# Altium project 20E-Bringup.PrjPcb (part 2 of 2)

## Sheet PWM-Generator.SchDoc
size A4
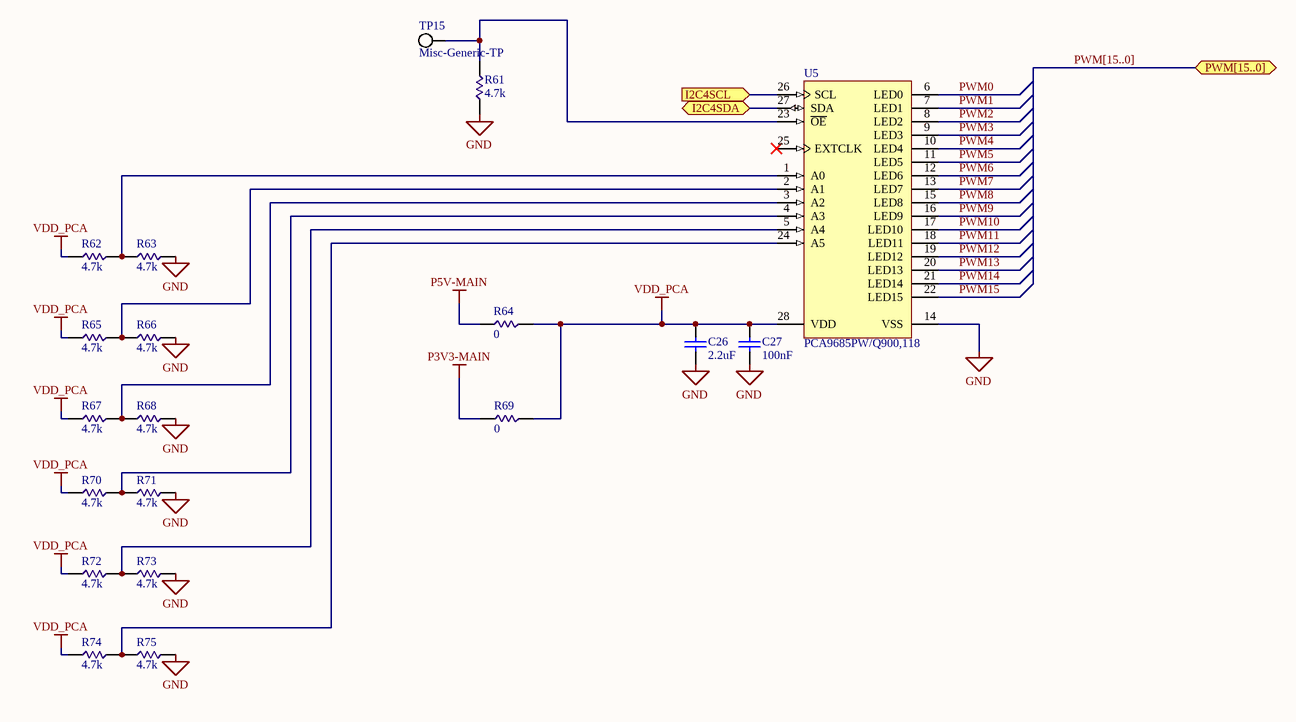
[diagram p11: PWM-Generator.SchDoc]

### Parts
C26  value 2.2uF  [FOOTPRINT-0805-GEN]  (hidden comment: C0805C225K8RACTU)
C27  value 100nF  [FOOTPRINT-0805-GEN]  (hidden comment: C0805C104K8RACTU)
R61  value 4.7k  [FOOTPRINT-0805-GEN]  (hidden comment: SMC)
R62  value 4.7k  [FOOTPRINT-0805-GEN]  (hidden comment: SMC)
R63  value 4.7k  [FOOTPRINT-0805-GEN]  (hidden comment: SMC)
R64  value 0  [FOOTPRINT-0805-GEN]  (hidden comment: SMC)
R65  value 4.7k  [FOOTPRINT-0805-GEN]  (hidden comment: SMC)
R66  value 4.7k  [FOOTPRINT-0805-GEN]  (hidden comment: SMC)
R67  value 4.7k  [FOOTPRINT-0805-GEN]  (hidden comment: SMC)
R68  value 4.7k  [FOOTPRINT-0805-GEN]  (hidden comment: SMC)
R69  value 0  [FOOTPRINT-0805-GEN]  (hidden comment: SMC)
R70  value 4.7k  [FOOTPRINT-0805-GEN]  (hidden comment: SMC)
R71  value 4.7k  [FOOTPRINT-0805-GEN]  (hidden comment: SMC)
R72  value 4.7k  [FOOTPRINT-0805-GEN]  (hidden comment: SMC)
R73  value 4.7k  [FOOTPRINT-0805-GEN]  (hidden comment: SMC)
R74  value 4.7k  [FOOTPRINT-0805-GEN]  (hidden comment: SMC)
R75  value 4.7k  [FOOTPRINT-0805-GEN]  (hidden comment: SMC)
TP15  Misc-Generic-TP  [FOOTPRINT-GENERIC-TP-VIA-1MM]
U5  PCA9685PW/Q900,118  [FOOTPRINT-NXP-PCA9685]

### Ports
I2C4SCL (in), I2C4SDA (bidir), PWM[15..0] (bidir)

### Nets
GND: C26.2 C27.1 R61.1 R63.2 R66.2 R68.2 R71.2 R73.2 R75.2 U5.14(VSS)
P3V3-MAIN: R69.1
P5V-MAIN: R64.2
VDD_PCA: C26.1 C27.2 R62.2 R64.1 R65.2 R67.2 R69.2 R70.2 R72.2 R74.2 U5.28(VDD)
I2C4SCL: U5.26(SCL) ; port I2C4SCL
I2C4SDA: U5.27(SDA) ; port I2C4SDA
PWM0: U5.6(LED0)
PWM1: U5.7(LED1)
PWM2: U5.8(LED2)
PWM3: U5.9(LED3)
PWM4: U5.10(LED4)
PWM5: U5.11(LED5)
PWM6: U5.12(LED6)
PWM7: U5.13(LED7)
PWM8: U5.15(LED8)
PWM9: U5.16(LED9)
PWM10: U5.17(LED10)
PWM11: U5.18(LED11)
PWM12: U5.19(LED12)
PWM13: U5.20(LED13)
PWM14: U5.21(LED14)
PWM15: U5.22(LED15)
NetR61_2: R61.2 TP15.1(TP) U5.23(~{OE})
NetR62_1: R62.1 R63.1 U5.1(A0)
NetR65_1: R65.1 R66.1 U5.2(A1)
NetR67_1: R67.1 R68.1 U5.3(A2)
NetR70_1: R70.1 R71.1 U5.4(A3)
NetR72_1: R72.1 R73.1 U5.5(A4)
NetR74_1: R74.1 R75.1 U5.24(A5)

Not connected (* = marked no-connect by the designer): U5 25(EXTCLK)*

### Buses and harness runs
bus PWM[15..0] = port PWM[15..0]

### Notes on the sheet
- Title
- Size:
- Date:
- Engineer
- A4
- Number:
- Sheet
- of
- Approved
- Revision:
- UC Riverside
- www.highlanderracing.org <https://www.highlanderracing.org>
- File:

### Library data of the parts
C26 C27 = Capacitor-Generic-0805: Capacitor; Published: 8-Jun-2000; LatestRevisionDate: 17-Jul-2002; LatestRevisionNote: Re-released for DXP Platform.; PackageReference: RAD-0.3; Publisher: Altium Limited; PackageDescription: Radial Cap, Thru-Hole; 2 Leads; 0.3 in Pin Spacing
R61-R75 = Resistor-Generic-0805-2012: 1/8 Watt Surface Mount Resistor
U5 = IC-NXP-PCA9685: 16-Channel, 12-Bit PWM Fm+ I2C-Bus LED Controller, 2.3 to 5.5 V, -40 to 85 degC, 28-Pin TSSOP (SOT361-1), RoHS, Tape and Reel; Supply Voltage Max: 5.5 V; Supply Current Max: 10 mA; Supply Voltage Min: 2.3 V; Frequency: 25000000 Hz; ComponentLink1Description: Manufacturer URL; PackageVersion: 02/2003; PackageDescription: 28-Pin Small Outline Package, Body 9.7 x 4.4 mm, Pitch 0.65 mm; Packing: Tape and Reel; ComponentLink2URL: http://www.nxp.com/documents/data_sheet/PCA9685.pdf; ComponentLink1URL: http://www.nxp.com/; Mounting Technology: Surface Mount; PartNumber: PCA9685; ComponentLink2Description: Datasheet; Temperature Min: -40 degC; ComponentLink3URL: http://www.nxp.com/documents/outline_drawing/sot361-1_po.pdf; Temperature Max: 85 degC; DatasheetVersion: Rev. 4; ComponentLink3Description: Package Specification; RoHS: TRUE; Code_JEDEC: MO-153

## Nets that join several sheets
GND: Connectors (29 pins), Power-Tree-VBATT-Filter (P24.1 P24.2), Power-Tree-Main (18 pins), Power-Tree-Secondary (17 pins), TM4C (22 pins), CAN-Interface (6 pins), Pin-Filters (11 pins), PWM-Generator (10 pins)
P3V3-MAIN: Connectors (P7.1 P18.22 R1.1), Power-Tree-Main (R84.2), Power-Tree-Secondary (10 pins), TM4C (16 pins), TM4C-Interfaces (R19.2 R22.2), UART-Interface (12 pins), I2C-Interface (12 pins), Pin-Filters (D1.2 D2.2 D3.2 D4.2), PWM-Generator (R69.1)
P5V-MAIN: Connectors (P5.1 P18.21), Power-Tree-Main (9 pins), CAN-Interface (C17.2 C18.2 U3.3 U4.3), UART-Interface (6 pins), I2C-Interface (6 pins), PWM-Generator (R64.2)
PVBUS: Connectors (P6.1), Power-Tree-VBATT-Filter (P23.1 P23.2), Power-Tree-Main (8 pins), Power-Tree-Secondary (7 pins)
AIN0-1: TM4C-Interfaces (U1.6), Pin-Filters (C21.2 D2.3 R56.2)
AIN1-1: TM4C-Interfaces (U1.7), Pin-Filters (C19.2 D1.3 R54.2)
AIN8-1: TM4C-Interfaces (U1.60), Pin-Filters (C25.2 D4.3 R60.2)
AIN9-1: TM4C-Interfaces (U1.59), Pin-Filters (C23.2 D3.3 R58.2)
CAN0RX: TM4C-Interfaces (U1.58), CAN-Interface (R39.1)
CAN0TX: TM4C-Interfaces (U1.57), CAN-Interface (R38.1)
CAN1RX: TM4C-Interfaces (U1.17), CAN-Interface (R41.1)
CAN1TX: TM4C-Interfaces (U1.18), CAN-Interface (R40.1)
GPIO-PC0: Connectors (P18.14 R4.2), TM4C-Interfaces (U1.52)
GPIO-PC1: Connectors (P18.13 R2.2), TM4C-Interfaces (U1.51)
GPIO-PC2: Connectors (R8.2), TM4C-Interfaces (U1.50)
GPIO-PC3: Connectors (R6.2), TM4C-Interfaces (U1.49)
GPIO-PC7: Connectors (P18.5), TM4C-Interfaces (U1.13)
GPIO-PD2: Connectors (P18.19), TM4C-Interfaces (U1.63)
GPIO-PD3: Connectors (P18.20), TM4C-Interfaces (U1.64)
GPIO-PD6: Connectors (P18.15), TM4C-Interfaces (U1.53)
GPIO-PD7: Connectors (P18.4), TM4C-Interfaces (U1.10)
GPIO-PF4: Connectors (P18.3), TM4C-Interfaces (U1.5)
I2C1SCL: TM4C-Interfaces (U1.23), I2C-Interface (Q7.2 R42.1 TP9.1)
I2C1SDA: TM4C-Interfaces (U1.24), I2C-Interface (Q8.2 R44.1 TP10.1)
I2C3SCL: TM4C-Interfaces (U1.37), I2C-Interface (Q9.2 R46.1 TP11.1)
I2C3SDA: TM4C-Interfaces (U1.36), I2C-Interface (Q10.2 R47.1 TP12.1)
I2C4SCL: TM4C-Interfaces (U1.35), I2C-Interface (Q11.2 R50.1 TP13.1), PWM-Generator (U5.26)
I2C4SDA: TM4C-Interfaces (U1.34), I2C-Interface (Q12.2 R52.1 TP14.1), PWM-Generator (U5.27)
M1PWM0: Connectors (P18.17), TM4C-Interfaces (U1.61)
M1PWM1: Connectors (P18.18), TM4C-Interfaces (U1.62)
NetC4_2: Connectors (R10.2), TM4C (C4.2 R15.2 U1.38)
NetP2_1: Connectors (P2.1), UART-Interface (Q5.3 R35.2)
NetP2_2: Connectors (P2.2), UART-Interface (Q6.3 R37.2)
NetP2_4: Connectors (P2.4), UART-Interface (Q1.3 R27.2)
NetP2_5: Connectors (P2.5), UART-Interface (Q2.3 R29.2)
NetP2_7: Connectors (P2.7), UART-Interface (Q3.3 R31.2)
NetP2_8: Connectors (P2.8), UART-Interface (Q4.3 R33.2)
NetP9_3: Connectors (P9.3), I2C-Interface (Q8.3 R45.2)
NetP9_4: Connectors (P9.4), I2C-Interface (Q7.3 R43.2)
NetP11_1: Connectors (P11.1), TM4C-Interfaces (R21.2)
NetP11_2: Connectors (P11.2), TM4C-Interfaces (R23.2)
NetP11_3: Connectors (P11.3), TM4C-Interfaces (R24.2)
NetP11_4: Connectors (P11.4), TM4C-Interfaces (R25.2)
NetP11_6: Connectors (P11.6), TM4C-Interfaces (R16.2)
NetP11_7: Connectors (P11.7), TM4C-Interfaces (R17.2)
NetP11_8: Connectors (P11.8), TM4C-Interfaces (R18.2)
NetP11_9: Connectors (P11.9), TM4C-Interfaces (R20.2)
NetP13_2: Connectors (P13.2), I2C-Interface (Q10.3 R49.2)
NetP13_3: Connectors (P13.3), I2C-Interface (Q9.3 R48.2)
NetP15_2: Connectors (P15.2), I2C-Interface (Q12.3 R53.2)
NetP15_3: Connectors (P15.3), I2C-Interface (Q11.3 R51.2)
NetP21_1: Connectors (P21.1), Pin-Filters (R59.1)
NetP21_2: Connectors (P21.2), Pin-Filters (R60.1)
NetP21_3: Connectors (P21.3), Pin-Filters (R57.1)
NetP21_4: Connectors (P21.4), Pin-Filters (R58.1)
NetP21_5: Connectors (P21.5), Pin-Filters (R55.1)
NetP21_6: Connectors (P21.6), Pin-Filters (R56.1)
NetP21_8: Connectors (P21.8), Pin-Filters (R54.1)
NetP25_1: Connectors (P25.1 R78.2), CAN-Interface (U4.7)
NetP25_3: Connectors (P25.3 R79.1), CAN-Interface (U4.6)
NetP26_1: Connectors (P26.1 R76.2), CAN-Interface (U3.7)
NetP26_3: Connectors (P26.3 R77.1), CAN-Interface (U3.6)
PWM0: Connectors (P8.3), PWM-Generator (U5.6)
PWM1: Connectors (P10.3), PWM-Generator (U5.7)
PWM2: Connectors (P12.3), PWM-Generator (U5.8)
PWM3: Connectors (P14.3), PWM-Generator (U5.9)
PWM4: Connectors (P16.3), PWM-Generator (U5.10)
PWM5: Connectors (P17.3), PWM-Generator (U5.11)
PWM6: Connectors (P19.3), PWM-Generator (U5.12)
PWM7: Connectors (P20.3), PWM-Generator (U5.13)
PWM8: Connectors (P22.1), PWM-Generator (U5.15)
PWM9: Connectors (P22.2), PWM-Generator (U5.16)
PWM10: Connectors (P22.3), PWM-Generator (U5.17)
PWM11: Connectors (P22.4), PWM-Generator (U5.18)
PWM12: Connectors (P22.5), PWM-Generator (U5.19)
PWM13: Connectors (P22.6), PWM-Generator (U5.20)
PWM14: Connectors (P22.7), PWM-Generator (U5.21)
PWM15: Connectors (P22.8), PWM-Generator (U5.22)
QEI-IDX1: TM4C-Interfaces (U1.16), Pin-Filters (C24.2 R59.2)
QEI-PHA1: TM4C-Interfaces (U1.15), Pin-Filters (C22.2 R57.2)
QEI-PHB1: TM4C-Interfaces (U1.14), Pin-Filters (C20.2 R55.2)
TIMER0CCP0: Connectors (P18.1), TM4C-Interfaces (U1.1)
TIMER0CCP1: Connectors (P18.2), TM4C-Interfaces (U1.4)
TIMER3CCP0: Connectors (P18.9), TM4C-Interfaces (U1.47)
TIMER3CCP1: Connectors (P18.10), TM4C-Interfaces (U1.48)
UART1RX: TM4C-Interfaces (U1.45), UART-Interface (Q2.2 R28.1 TP2.1)
UART1TX: TM4C-Interfaces (U1.46), UART-Interface (Q1.2 R26.1 TP1.1)
UART6RX: TM4C-Interfaces (U1.43), UART-Interface (Q4.2 R32.1 TP4.1)
UART6TX: TM4C-Interfaces (U1.44), UART-Interface (Q3.2 R30.1 TP3.1)
UART7RX: TM4C-Interfaces (U1.9), UART-Interface (Q6.2 R36.1 TP6.1)
UART7TX: TM4C-Interfaces (U1.8), UART-Interface (Q5.2 R34.1 TP5.1)
WT0CCP0: Connectors (P18.7), TM4C-Interfaces (U1.33)
WT0CCP1: Connectors (P18.8), TM4C-Interfaces (U1.32)